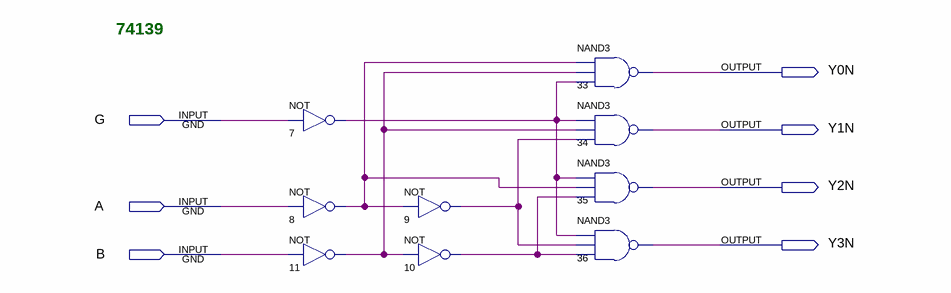
[diagram p0: schematic sheet]
// Quartus schematic 74139m.bdf as structural Verilog: 9 symbols, 7 pins
module \74139m  (
  input  G,
  input  A,
  input  B,
  output Y0N,
  output Y1N,
  output Y2N,
  output Y3N
);

  wire n7_out, n8_out, n9_out, n10_out, n11_out;

  not u_7 (n7_out, G);
  not u_8 (n8_out, A);
  not u_11 (n11_out, B);
  not u_9 (n9_out, n8_out);
  not u_10 (n10_out, n11_out);
  nand u_33 (Y0N, n8_out, n11_out, n7_out);
  nand u_34 (Y1N, n7_out, n11_out, n9_out);
  nand u_35 (Y2N, n7_out, n8_out, n10_out);
  nand u_36 (Y3N, n7_out, n9_out, n10_out);

  // Notes on the sheet:
  //   74139
endmodule
